# EAGLE design Debugging_Board (EAGLE 7.6.0)
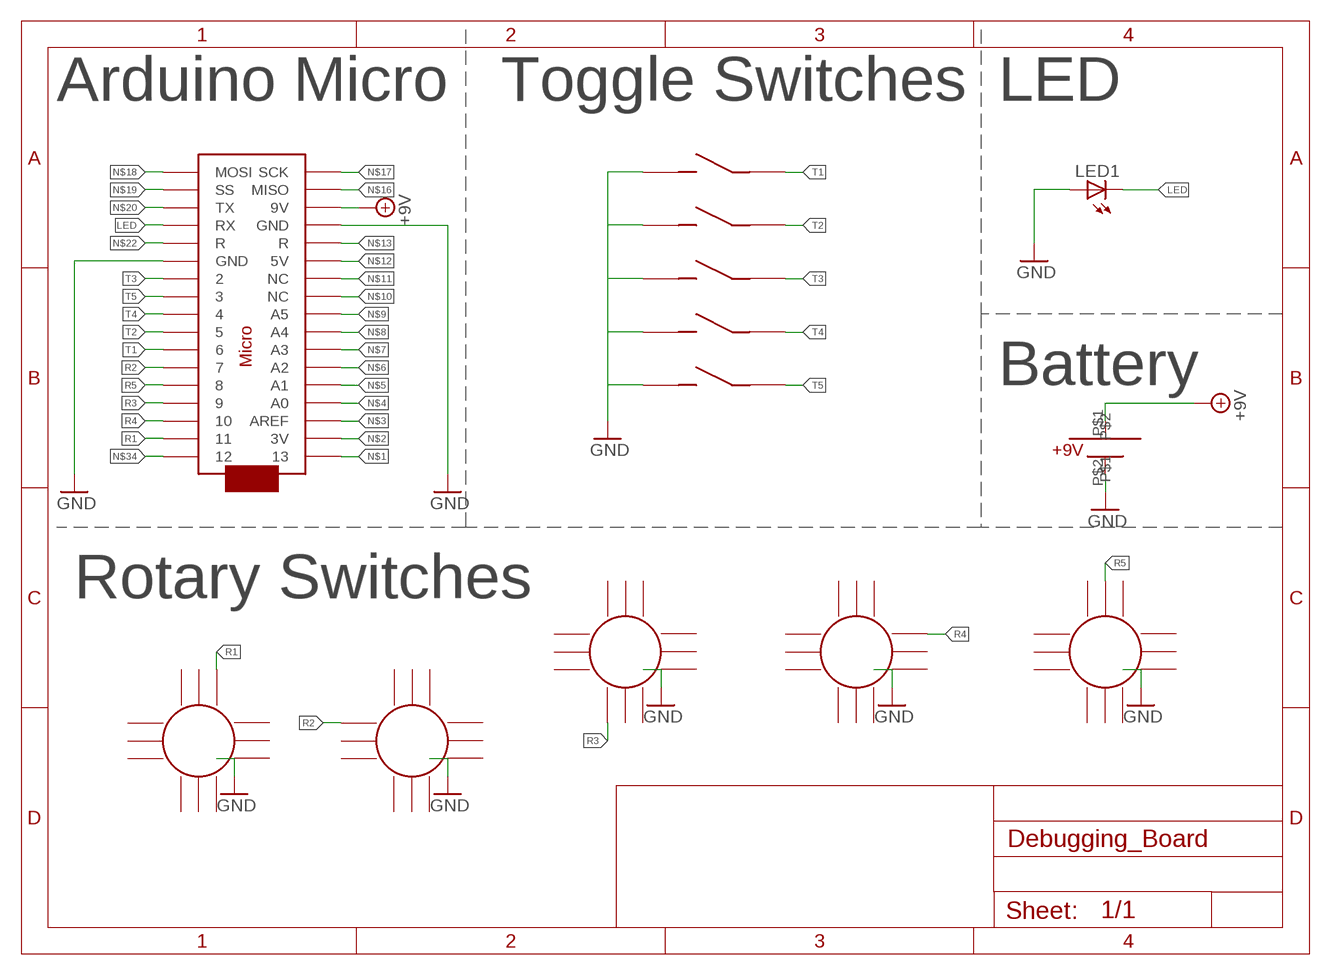
[diagram p0: schematic, sheet 1]

## Parts
LED1  LED5MM  [LED5MM]
U$1  ARDUINOMICRO  [ARDUINOMICRO]
U$2  TOGGLE  [SWITCH]
U$3  TOGGLE  [SWITCH]
U$4  TOGGLE  [SWITCH]
U$5  TOGGLE  [SWITCH]
U$6  TOGGLE  [SWITCH]
U$7  ROTARY  [ROTARY]
U$8  ROTARY  [ROTARY]
U$9  ROTARY  [ROTARY]
U$10  ROTARY  [ROTARY]
U$11  ROTARY  [ROTARY]
U$12  BATTERY  [BATTERY]

## Nets
+9V: U$1.P$20(9V) U$12.P$1
GND: LED1.A U$1.P$12(GND) U$1.P$21(GND) U$2.P$1 U$3.P$1 U$4.P$1 U$5.P$1 U$6.P$1 U$7.P$13 U$8.P$13 U$9.P$13 U$10.P$13 U$11.P$13 U$12.P$2
LED: LED1.K(C) U$1.P$14(RX)
N$1: U$1.P$34
N$2: U$1.P$33(3V)
N$3: U$1.P$32(AREF)
N$4: U$1.P$31(A0)
N$5: U$1.P$30(A1)
N$6: U$1.P$29(A2)
N$7: U$1.P$28(A3)
N$8: U$1.P$27(A4)
N$9: U$1.P$26(A5)
N$10: U$1.P$25(NC)
N$11: U$1.P$24(NC)
N$12: U$1.P$23(5V)
N$13: U$1.P$13(R)
N$16: U$1.P$19(MISO)
N$17: U$1.P$18(SCK)
N$18: U$1.P$17(MOSI)
N$19: U$1.P$16(SS)
N$20: U$1.P$15(TX)
N$22: U$1.P$22(R)
N$34: U$1.P$1
R1: U$1.P$2 U$7.P$3
R2: U$1.P$6 U$8.P$12
R3: U$1.P$4 U$9.P$9
R4: U$1.P$3 U$10.P$4
R5: U$1.P$5 U$11.P$2
T1: U$1.P$7 U$2.P$2
T2: U$1.P$8 U$3.P$2
T3: U$1.P$11 U$4.P$2
T4: U$1.P$9 U$5.P$2
T5: U$1.P$10 U$6.P$2
Unconnected: U$7.P$1 U$7.P$2 U$7.P$4 U$7.P$5 U$7.P$6 U$7.P$7 U$7.P$8 U$7.P$9 U$7.P$10 U$7.P$11 U$7.P$12 U$8.P$1 U$8.P$2 U$8.P$3 U$8.P$4 U$8.P$5 U$8.P$6 U$8.P$7 U$8.P$8 U$8.P$9 U$8.P$10 U$8.P$11 U$9.P$1 U$9.P$2 U$9.P$3 U$9.P$4 U$9.P$5 U$9.P$6 U$9.P$7 U$9.P$8 U$9.P$10 U$9.P$11 U$9.P$12 U$10.P$1 U$10.P$2 U$10.P$3 U$10.P$5 U$10.P$6 U$10.P$7 U$10.P$8 U$10.P$9 U$10.P$10 U$10.P$11 U$10.P$12 U$11.P$1 U$11.P$3 U$11.P$4 U$11.P$5 U$11.P$6 U$11.P$7 U$11.P$8 U$11.P$9 U$11.P$10 U$11.P$11 U$11.P$12

## Notes on the sheet
- Arduino Micro | Toggle Switches | LED
- Battery
- Rotary Switches

## Library data of the parts
LED1 = SparkFun:LED: LEDs Standard schematic elements and footprints for 5mm, 3mm, 1206, and 0603 sized LEDs. 5mm - Spark Fun Electronics SKU : COM-00529 (and others)
U$1 = adafruit:ARDUINOMICRO
U$2-U$6 = Switches:TOGGLE
U$7-U$11 = Switches:ROTARY
U$12 = Switches:BATTERY

## Board
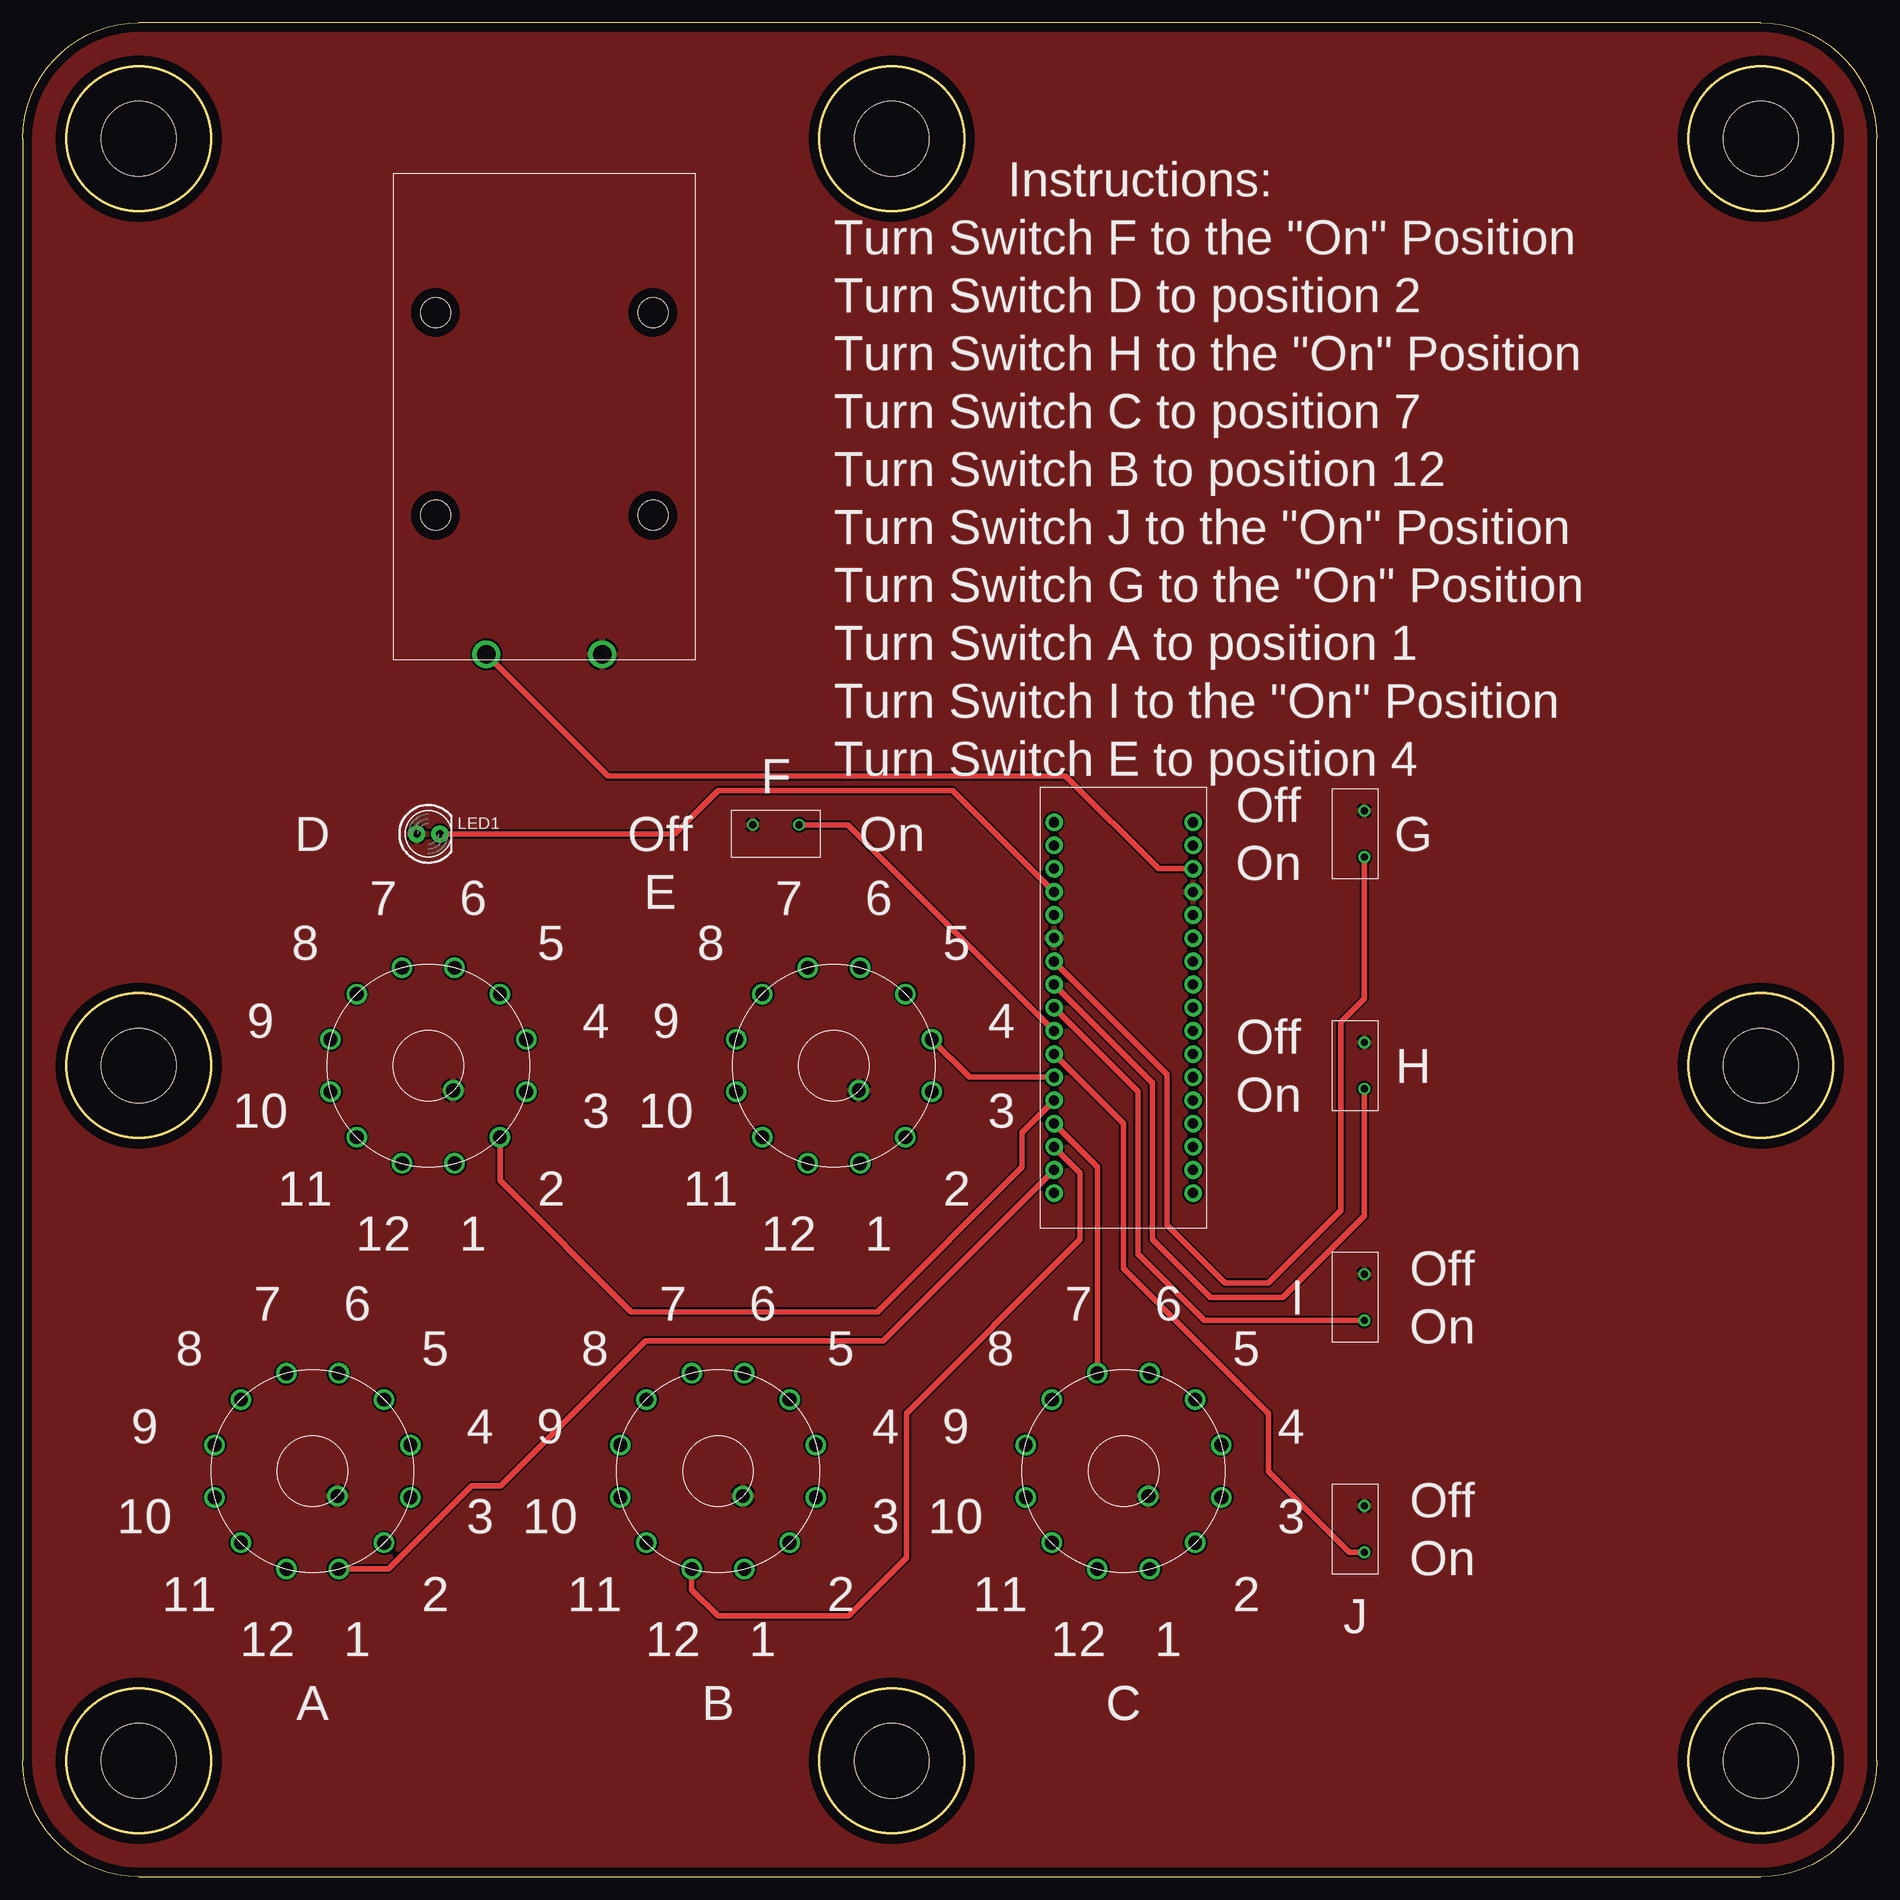
[diagram p1: board, top side]
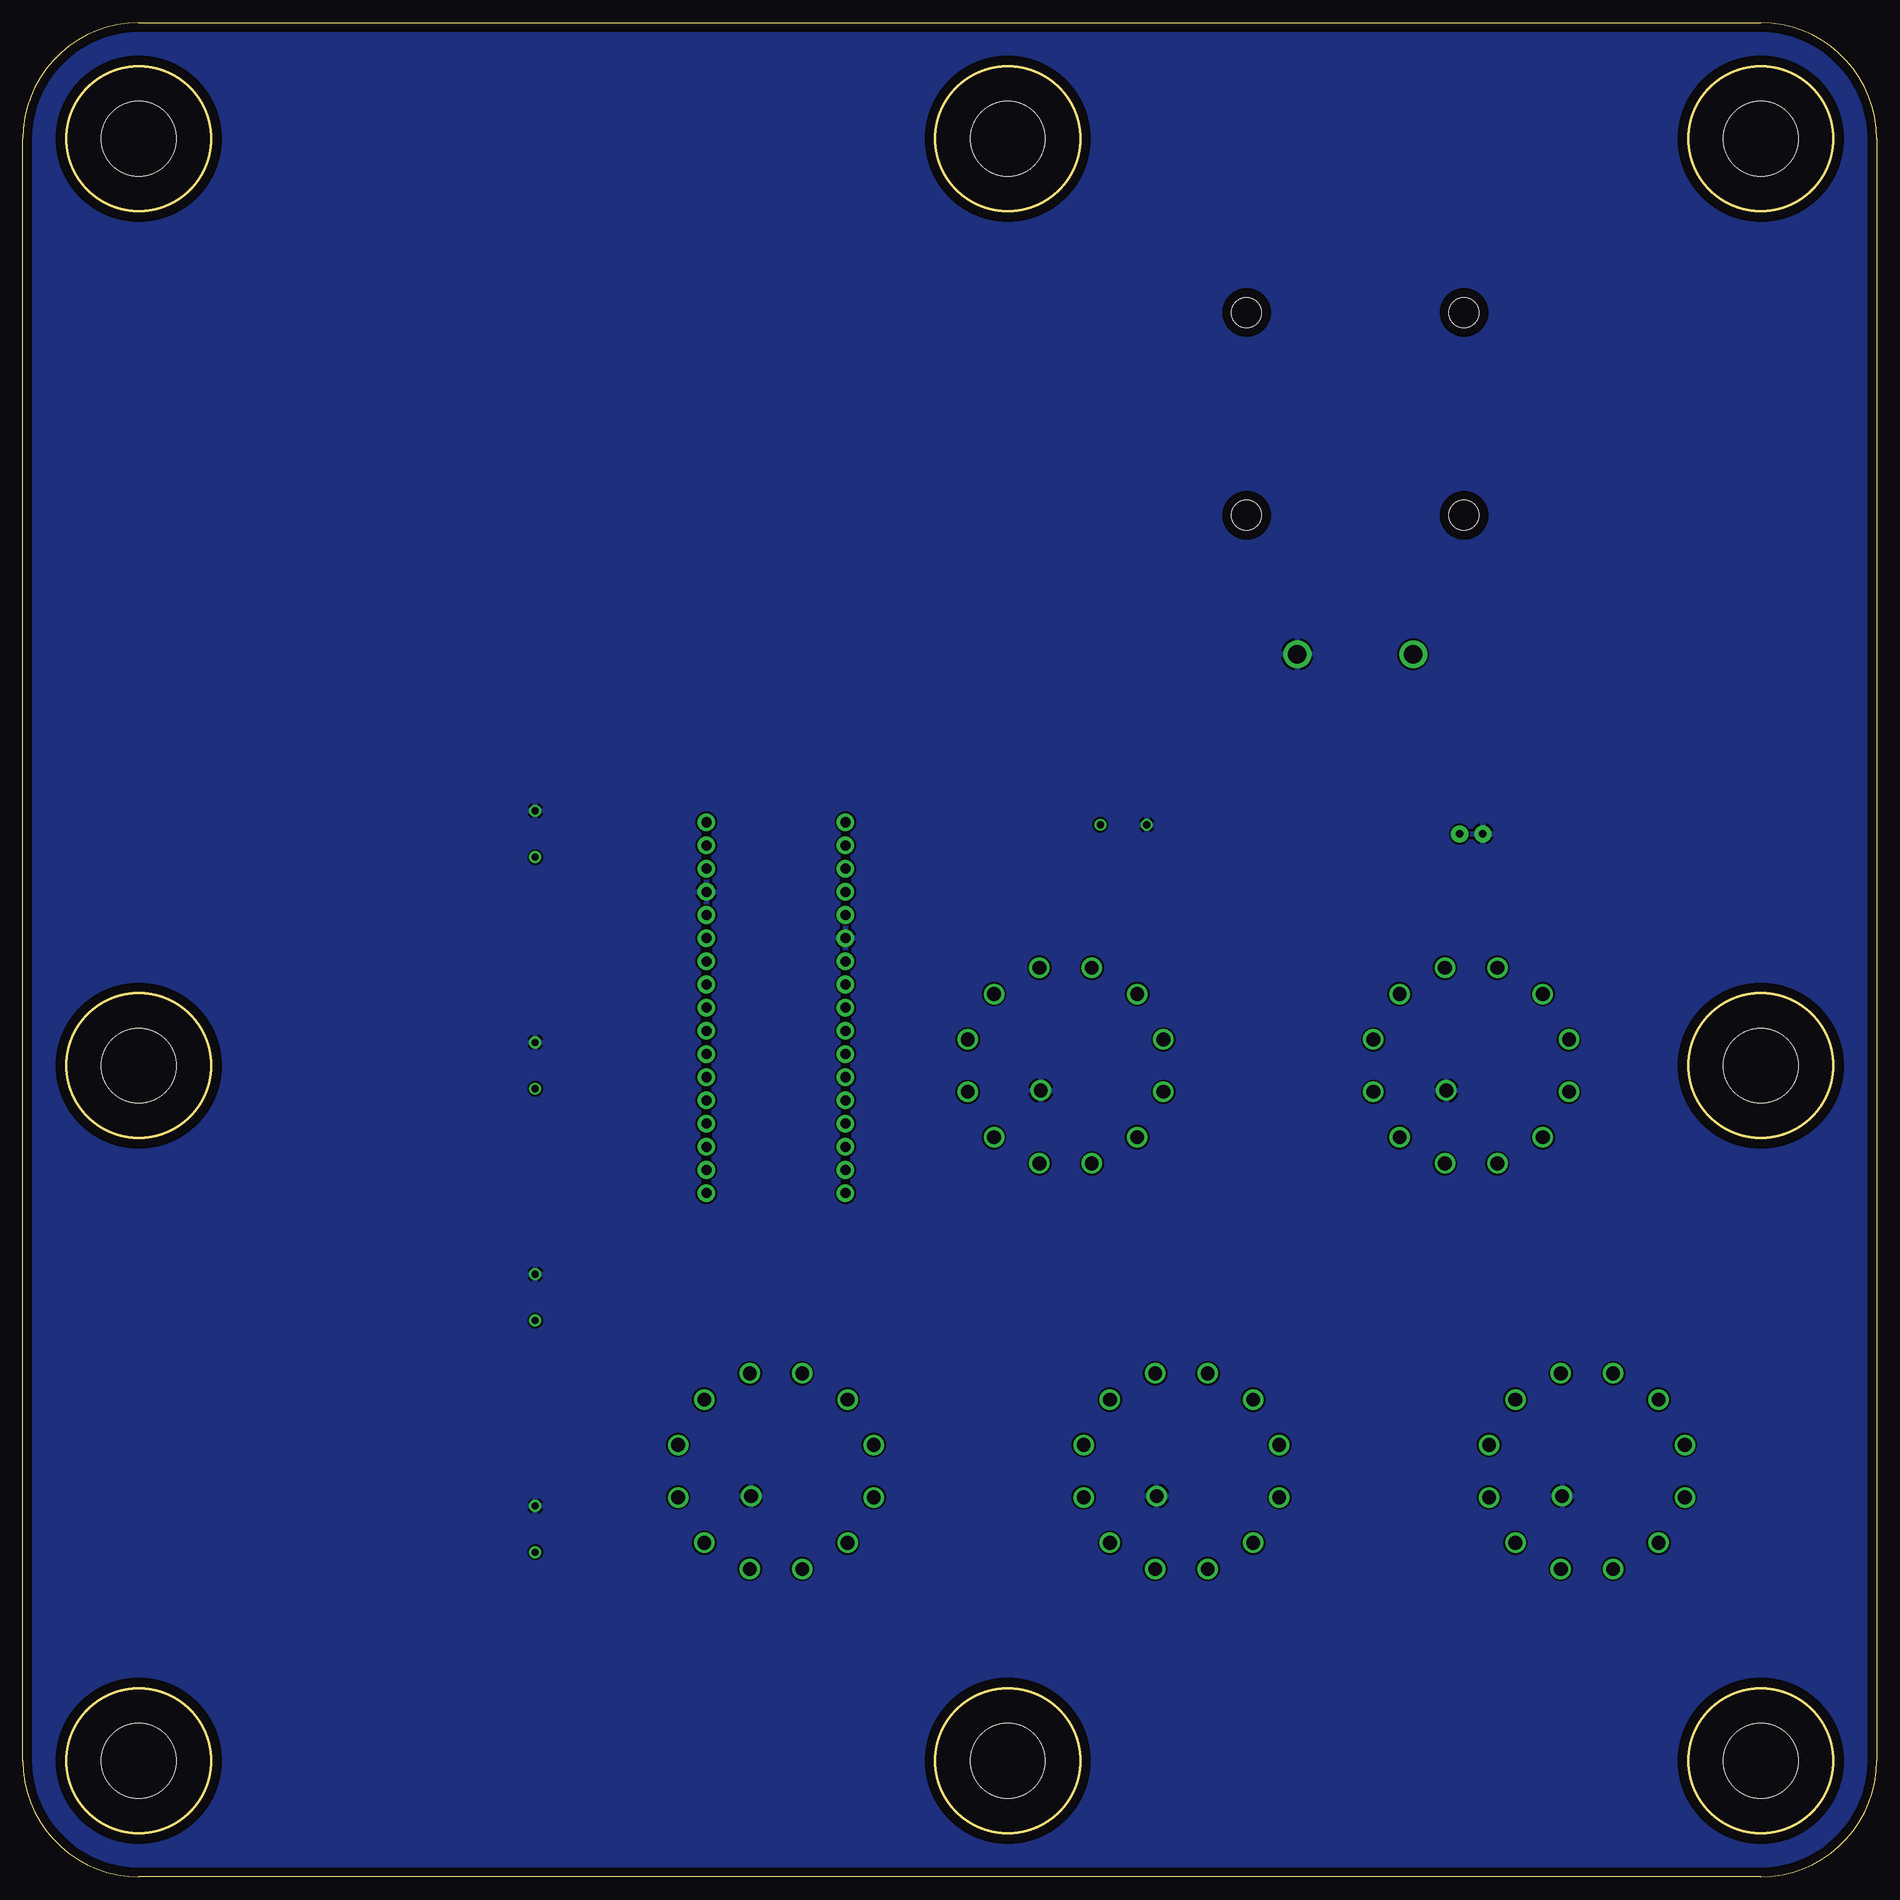
[diagram p2: board, bottom side, seen from below]

Size 203.2 x 203.2 mm. Coordinates in mm from the lower left corner, seen from the top.
Outline: 190.5,0 12.7,0 arc-90 0,12.7 0,190.5 arc-90 12.7,203.2 190.5,203.2 arc-90 203.2,190.5 203.2,12.7
Outline: 203.2,12.7 arc-90 190.5,0
Outline: 203.2,12.7 arc-90 190.5,0
Outline: circle at 12.7,12.7 radius 7.94
Outline: circle at 12.7,88.9 radius 7.94
Outline: circle at 12.7,190.5 radius 7.94
Outline: circle at 95.25,190.5 radius 7.94
Outline: circle at 190.5,190.5 radius 7.94
Outline: circle at 190.5,88.9 radius 7.94
Outline: circle at 190.5,12.7 radius 7.94
Outline: circle at 95.25,12.7 radius 7.94
Copper layers (1*16): Top 0.035mm / dielectric 1.5mm / Bottom 0.035mm
Design rules "default": minimum track width 10mil, minimum drill 24mil, track to track 8mil, track to pad 8mil, pad to pad 8mil, via to via 8mil, smd to smd 8mil, copper to edge 40mil, drill to drill 8mil, minimum pad ring 10mil, minimum via ring 8mil, stop-mask expansion 4mil, vias tented up to drill 0mil, thermal gap 10mil
Holes 8.2 mm at 12.7,12.7 12.7,88.9 12.7,190.5 95.25,190.5 190.5,190.5 190.5,88.9 190.5,12.7 95.25,12.7

### Footprints (pad centres in the part's own frame; a part is rotated, then mirrored left to right if it is on the bottom)
LED5MM = drill 0.813 pad 1.88: A -1.27,0; K 1.27,0
ARDUINOMICRO = drill 1.1 pad 1.93: P$1 -20.32,7.62; P$2 -17.78,7.62; P$3 -15.24,7.62; P$4 -12.7,7.62; P$5 -10.16,7.62; P$6 -7.62,7.62; P$7 -5.08,7.62; P$8 -2.54,7.62; P$9 0,7.62; P$10 2.54,7.62; P$11 5.08,7.62; P$12 12.7,-7.62; P$13 10.16,-7.62; P$14 12.7,7.62; P$15 15.24,7.62; P$16 17.78,7.62; P$17 20.32,7.62; P$18 20.32,-7.62; P$19 17.78,-7.62; P$20 15.24,-7.62; P$21 7.62,7.62; P$22 10.16,7.62; P$23 7.62,-7.62; P$24 5.08,-7.62; P$25 2.54,-7.62; P$26 0,-7.62; P$27 -2.54,-7.62; P$28 -5.08,-7.62; P$29 -7.62,-7.62; P$30 -10.16,-7.62; P$31 -12.7,-7.62; P$32 -15.24,-7.62; P$33 -17.78,-7.62; P$34 -20.32,-7.62
SWITCH = drill 0.787: P$1 0.991,2.54; P$2 0.991,-2.54
ROTARY = drill 1.499: P$1 10.721,-2.873; P$2 7.849,-7.849; P$3 2.873,-10.721; P$4 -2.873,-10.721; P$5 -7.849,-7.849; P$6 -10.721,-2.873; P$7 -10.721,2.873; P$8 -7.849,7.849; P$9 -2.873,10.721; P$10 2.873,10.721; P$11 7.849,7.849; P$12 10.721,2.873; P$13 2.72,-2.72
BATTERY = drill 2.032: P$1 -6.35,-37.465; P$2 6.35,-37.465 | hole 3.302: -11.913,0; 11.913,0; 11.913,-22.225; -11.913,-22.225

### Placement (x,y rotation side)
LED1  44.45,114.3 0 top
U$1  120.65,95.25 90 top
U$2  146.05,38.1 0 top
U$3  82.55,114.3 90 top
U$4  146.05,114.3 0 top
U$5  146.05,63.5 0 top
U$6  146.05,88.9 0 top
U$7  31.75,44.45 0 top
U$8  88.9,88.9 0 top
U$9  120.65,44.45 0 top
U$10  76.2,44.45 0 top
U$11  44.45,88.9 0 top
U$12  57.15,171.45 0 top

### Tracks (layer width: path | path; a pad name or v marks a point on that pad's centre or on a via)
+9V
  Top 0.61: U$12.P$1 64.14,120.65 114.3,120.65 124.46,110.49 U$1.P$20
GND
  pour Top: -6.35,209.55 209.55,209.55 209.55,-6.35 -6.35,-6.35
  pour Bottom: -12.7,215.9 215.9,215.9 215.9,-12.7 -12.7,-12.7
LED
  Top 0.61: LED1.K 71.44,114.3 76.2,119.06 101.92,119.06 U$1.P$14
R1
  Top 0.61: U$7.P$3 40.08,33.73 49.21,42.86 52.39,42.86 68.26,58.74 94.3,58.74 U$1.P$2
R2
  Top 0.61: U$8.P$12 103.76,87.63 U$1.P$6
R3
  Top 0.61: U$9.P$9 117.78,77.8 U$1.P$4
R4
  Top 0.61: U$10.P$4 73.33,31.45 76.2,28.57 90.49,28.57 96.84,34.92 96.84,50.8 115.89,69.85 115.89,77.15 U$1.P$3
R5
  Top 0.61: U$11.P$2 52.3,76.29 66.67,61.91 93.66,61.91 109.54,77.79 109.54,81.6 U$1.P$5
T1
  Top 0.61: U$2.P$2 145.41,35.56 136.53,44.45 136.53,50.8 120.65,66.67 120.65,82.55 U$1.P$7
T2
  Top 0.61: U$3.P$2 90.45,115.29 U$1.P$8
T3
  Top 0.61: U$4.P$2 147.04,96.24 144.46,93.66 144.46,73.03 136.53,65.09 131.76,65.09 125.41,71.44 125.41,87.95 U$1.P$11
T4
  Top 0.61: U$5.P$2 129.54,60.96 122.24,68.26 122.24,86.04 U$1.P$9
T5
  Top 0.61: U$6.P$2 147.04,72.43 138.11,63.5 130.18,63.5 123.83,69.85 123.83,87 U$1.P$10

### Text on the board
tPlace: Instructions: | Turn Switch F to the "On" Position | Turn Switch D to position 2 | Turn Switch H to the "On" Position | Turn Switch C to position 7 | Turn Switch B to position 12 | Turn Switch J to the "On" Position | Turn Switch G to the "On" Position | Turn Switch A to position 1 | Turn Switch I to the "On" Position | F | Turn Switch E to position 4 | Off | D | Off | On | G | On | E | 7 | 6 | 7 | 6 | 8 | 5 | 8 | 5 | 9 | 4 | 9 | 4 | Off | H | On | 10 | 3 | 10 | 3 | 11 | 2 | 11 | 2 | 12 | 1 | 12 | 1 | Off | I | 7 | 6 | 7 | 6 | 7 | 6 | On | 8 | 5 | 8 | 5 | 8 | 5 | 9 | 4 | 9 | 4 | 9 | 4 | Off | 10 | 3 | 10 | 3 | 10 | 3 | On | 11 | 2 | 11 | 2 | 11 | 2 | J | 12 | 1 | 12 | 1 | 12 | 1 | A | B | C